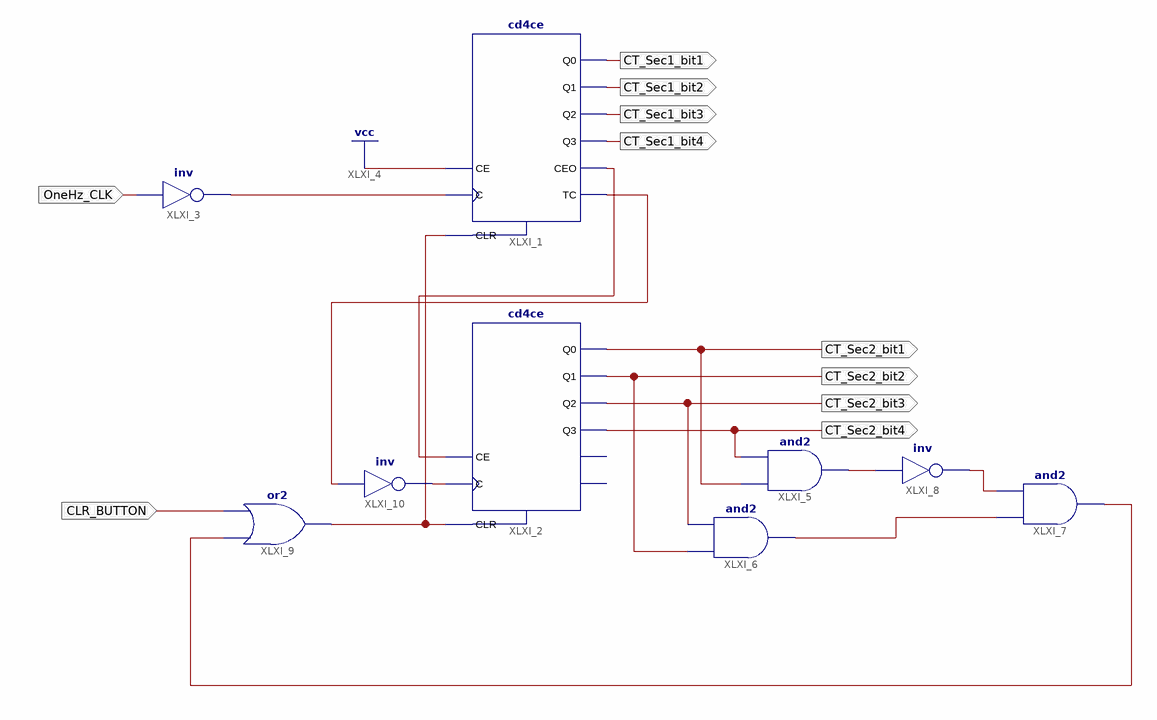
[diagram p0: schematic sheet 1]
// Xilinx ISE schematic Counter_Sec.sch (spartan6) as structural Verilog: 9 symbols, 10 ports
module Counter_Sec (
  input  OneHz_CLK,
  input  CLR_BUTTON,
  output CT_Sec2_bit1,
  output CT_Sec2_bit2,
  output CT_Sec2_bit3,
  output CT_Sec2_bit4,
  output CT_Sec1_bit1,
  output CT_Sec1_bit2,
  output CT_Sec1_bit3,
  output CT_Sec1_bit4
);

  wire XLXN_1, XLXN_22, XLXN_26, XLXN_27, XLXN_29, XLXN_32, XLXN_33, XLXN_34, XLXN_35;

  cd4ce XLXI_1 (
    .C(XLXN_33), .CE(1'b1), .CLR(XLXN_32), .CEO(XLXN_1), .Q0(CT_Sec1_bit1), .Q1(CT_Sec1_bit2),
    .Q2(CT_Sec1_bit3), .Q3(CT_Sec1_bit4), .TC(XLXN_34));
  cd4ce XLXI_2 (
    .C(XLXN_35), .CE(XLXN_1), .CLR(XLXN_32), .Q0(CT_Sec2_bit1), .Q1(CT_Sec2_bit2), .Q2(CT_Sec2_bit3),
    .Q3(CT_Sec2_bit4));  // open: CEO, TC
  not XLXI_3 (XLXN_33, OneHz_CLK);
  and XLXI_5 (XLXN_22, CT_Sec2_bit1, CT_Sec2_bit4);
  and XLXI_6 (XLXN_26, CT_Sec2_bit2, CT_Sec2_bit3);
  and XLXI_7 (XLXN_29, XLXN_26, XLXN_27);
  not XLXI_8 (XLXN_27, XLXN_22);
  or XLXI_9 (XLXN_32, XLXN_29, CLR_BUTTON);
  not XLXI_10 (XLXN_35, XLXN_34);
endmodule
